# EAGLE design untitled (EAGLE 5.06)
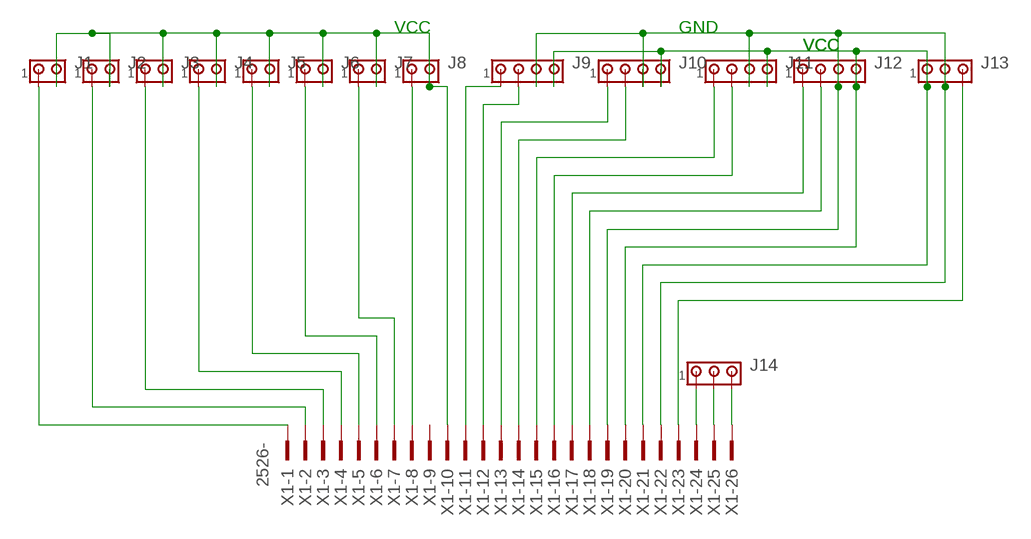
[diagram p0: schematic, sheet 1]

## Parts
J1  MTA02-100  [10X02MTA]
J2  MTA02-100  [10X02MTA]
J3  MTA02-100  [10X02MTA]
J4  MTA02-100  [10X02MTA]
J5  MTA02-100  [10X02MTA]
J6  MTA02-100  [10X02MTA]
J7  MTA02-100  [10X02MTA]
J8  MTA02-100  [10X02MTA]
J9  MTA04-100  [10X04MTA]
J10  MTA04-100  [10X04MTA]
J11  MTA04-100  [10X04MTA]
J12  MTA04-100  [10X04MTA]
J13  MTA03-100  [10X03MTA]
J14  MTA03-100  [10X03MTA]
X1  2526-  [PAK100/2500-26]

## Nets
N$1: J9.1 X1.11
N$2: J4.1 X1.4
N$3: J5.1 X1.5
N$4: J1.1 X1.1
N$5: J2.1 X1.2
N$6: J3.1 X1.3
N$7: J6.1 X1.6
N$9: J7.1 X1.7
N$10: J8.1 X1.8
N$11: J1.2 J2.2 J3.2 J4.2 J5.2 J6.2 J7.2 J8.2 X1.10
N$12: J9.4 J10.4 J11.4 J12.4 J13.1 X1.20 X1.21
N$13: J9.2 X1.12
N$14: J10.1 X1.13
N$15: J10.2 X1.14
N$16: J11.1 X1.15
N$17: J11.2 X1.16
N$18: J12.1 X1.17
N$19: J12.2 X1.18
N$20: J9.3 J10.3 J11.3 J12.3 J13.2 X1.19 X1.22
N$25: J13.3 X1.23
N$26: J14.1 X1.24
N$27: J14.2 X1.25
N$28: J14.3 X1.26
Unconnected: X1.9

## Notes on the sheet
- VCC | GND
- VCC | VCC

## Library data of the parts
J1-J8 = con-amp:MTA02-100: AMP connector
J9-J12 = con-amp:MTA04-100: AMP connector
J13 J14 = con-amp:MTA03-100: AMP connector
X1 = con-3m:2526-: 3M (TM) Pak 100 4-Wall Header Source: 3M

## Board
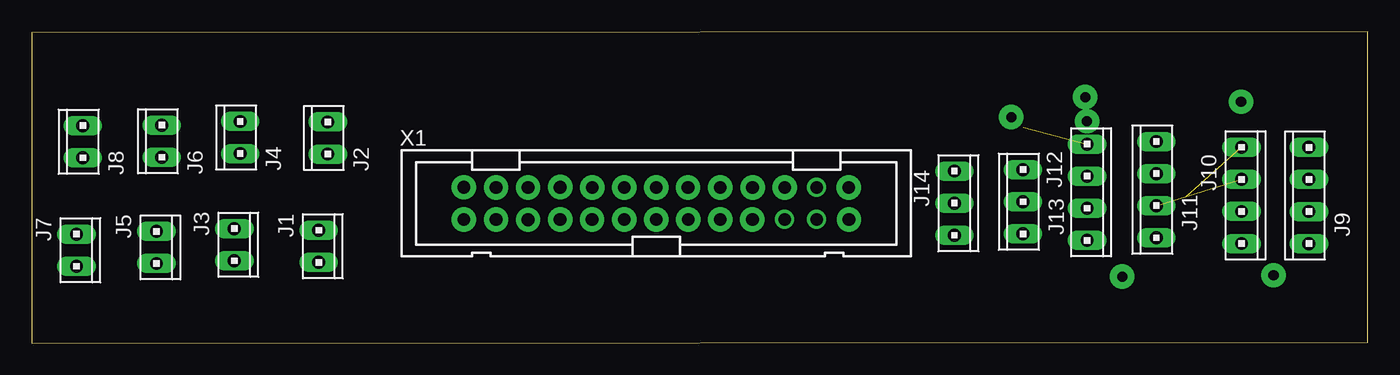
[diagram p1: board, top side]
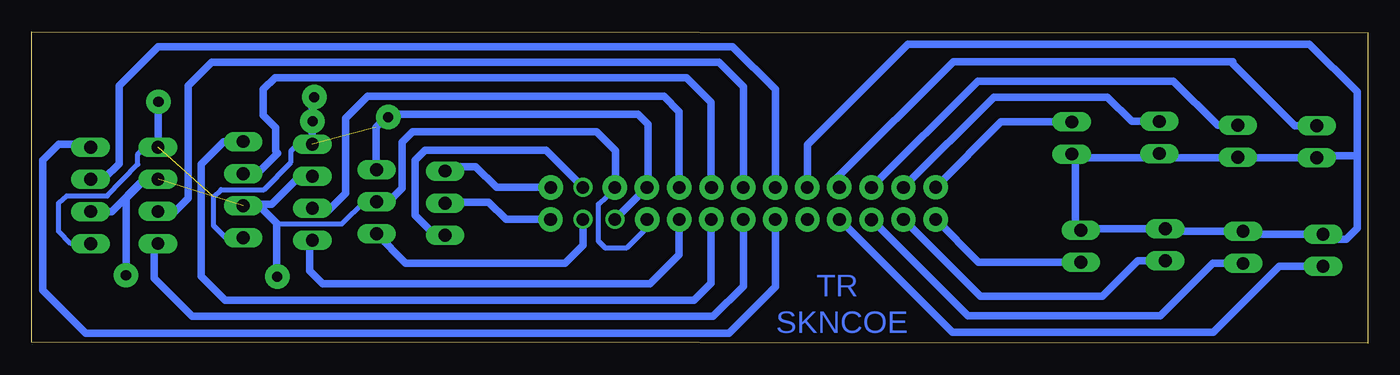
[diagram p2: board, bottom side, seen from below]

Size 105.83 x 24.66 mm. Coordinates in mm from the lower left corner, seen from the top.
Outline: 0,0 105.83,0.09 105.83,24.66 0,24.57 0,0
Copper layers (1*16): Top 0.035mm / dielectric 1.5mm / Bottom 0.035mm
Design rules "default": minimum track width 10mil, minimum drill 24mil, track to track 8mil, track to pad 8mil, pad to pad 8mil, via to via 8mil, smd to smd 8mil, copper to edge 40mil, drill to drill 8mil, minimum pad ring 10mil, minimum via ring 8mil, stop-mask expansion 4mil, vias tented up to drill 0mil, thermal gap 10mil

### Footprints (pad centres in the part's own frame; a part is rotated, then mirrored left to right if it is on the bottom)
10X02MTA = drill 1.016 long: 1 1.27,0; 2 -1.27,0
10X04MTA = drill 1.016 long: 1 3.81,0; 2 1.27,0; 3 -1.27,0; 4 -3.81,0
10X03MTA = drill 1.016 long: 1 2.54,0; 2 0,0; 3 -2.54,0
PAK100/2500-26 = drill 1 pad 1.422 round: 1 -15.24,-1.27; 2 -15.24,1.27; 3 -12.7,-1.27; 4 -12.7,1.27; 5 -10.16,-1.27; 6 -10.16,1.27; 7 -7.62,-1.27; 8 -7.62,1.27; 9 -5.08,-1.27; 10 -5.08,1.27; 11 -2.54,-1.27; 12 -2.54,1.27; 13 0,-1.27; 14 0,1.27; 15 2.54,-1.27; 16 2.54,1.27; 17 5.08,-1.27; 18 5.08,1.27; 19 7.62,-1.27; 20 7.62,1.27; 21 10.16,-1.27; 22 10.16,1.27; 23 12.7,-1.27; 24 12.7,1.27; 25 15.24,-1.27; 26 15.24,1.27

### Placement (x,y rotation side)
J1  22.74,7.66 270 top
J2  23.46,16.23 90 top
J3  16.06,7.79 270 top
J4  16.52,16.28 90 top
J5  9.88,7.57 270 top
J6  10.31,15.98 90 top
J7  3.55,7.35 270 top
J8  4.06,15.94 90 top
J9  101.16,11.69 90 top
J10  95.82,11.69 270 top
J11  89.07,12.15 90 top
J12  83.59,11.94 270 top
J13  78.51,11.19 90 top
J14  73.08,11.08 270 top
X1  49.47,11.06 0 top

### Tracks (layer width: path | path; a pad name or v marks a point on that pad's centre or on a via)
N$1
  Bottom 0.61: X1.11 46.93,4.44 50.61,0.77 101.55,0.77 104.95,4.17 104.95,14.47 103.68,15.74 101.4,15.74 J9.1
N$2
  Bottom 0.61: J4.1 18.7,17.55 20.62,19.46 29.64,19.46 X1.4
N$3
  Bottom 0.61: J5.1 12.27,6.3 16.43,2.15 31.67,2.15 X1.5
N$4
  Bottom 0.61: J1.1 30.83,6.39 X1.1
N$5
  Bottom 0.61: J2.1 29.06,17.5 X1.2
N$6
  Bottom 0.61: J3.1 18.22,6.52 21.04,3.69 30.67,3.69 X1.3
N$7
  Bottom 0.61: J6.1 11.91,17.25 15.4,20.75 30.89,20.75 X1.6
N$8  (via drill 0.8 pad 1.93)
  other vias: 98.35,5.37
N$9
  Bottom 0.61: J7.1 7.02,6.08 12.23,0.86 32.93,0.86 X1.7
N$10
  Bottom 0.61: 10.87,22.29 10.69,22.29 | J8.1 5.79,17.21 10.87,22.29 | 10.87,22.29 32.83,22.29 42,13.12 42,12.48 X1.8
N$11
  Bottom 0.61: 10.27,14.67 J8.2 | 10.27,14.67 J6.2 | 16.18,14.67 10.27,14.67 | 16.18,14.67 J4.2 | 23.17,14.67 16.18,14.67 | 23.17,14.67 J2.2 | 23.17,14.67 23.17,9.36 J1.2 22.61,9.06 16.68,9.06 | 16.68,9.06 J3.2 | 16.68,9.06 16.47,8.84 J5.2 9.66,8.62 J7.2 3.16,8.23 1.71,8.23 0.86,9.09 0.86,14.83 | X1.10 44.39,15.71 36.44,23.66 4.63,23.66 0.86,19.89 0.86,14.83 | 0.86,14.83 4.19,14.83 4.19,14.75
N$12  (2 unrouted)
  Bottom 0.406: J11.4 90.45,8.34 91.41,9.3 91.41,11.6 90.83,12.16 87.43,12.16 85.29,14.32 85.29,15.21 84.72,15.79 83.63,15.79 J12.4 | J9.4 102.73,7.88 103.7,8.84 103.7,11.1 103.06,11.66 99.83,11.66 97.41,14.15 97.41,14.95 96.76,15.6 95.92,15.6 J10.4
  Bottom 0.61: X1.20 X1.21 57.02,12.4 57.02,17.32 57.81,18.1 77.54,18.1 78.54,17.1 78.54,13.77 J13.1 | J10.4 95.82,19.03 95.81,19.04 | J12.4 83.59,19.13 83.55,19.18
N$13
  Bottom 0.61: X1.12 46.93,20.09 50.31,23.47 95.79,23.47 98.9,20.36 98.9,14.21 100.1,13.01 101.11,13.01 J9.2
N$14
  Bottom 0.61: X1.13 49.47,4.5 51.85,2.11 93.1,2.11 96.1,5.11 96.1,7.6 J10.1
N$15
  Bottom 0.61: X1.14 49.47,20.28 51.4,22.21 91.56,22.21 93.41,20.36 93.41,11.46 94.61,10.27 95.66,10.27 J10.2
N$16
  Bottom 0.61: X1.15 52.01,4.75 53.39,3.38 90.51,3.38 92.41,5.28 92.41,14.17 90.62,15.96 J11.1
N$17
  Bottom 0.61: X1.16 52.01,19.07 53.96,21.02 86.54,21.02 87.48,20.07 87.48,18.03 86.52,17.06 86.52,15.24 86.32,15.04 87.99,13.37 89.03,13.37 J11.2
N$18
  Bottom 0.61: X1.17 54.55,7.01 56.85,4.71 82.79,4.71 83.79,5.71 83.79,7.93 J12.1
N$19
  Bottom 0.61: X1.18 54.55,18.32 55.75,19.52 79.23,19.52 80.96,17.79 80.96,11.88 82.39,10.45 83.37,10.45 J12.2
N$20  (via drill 0.8 pad 1.93)  (1 unrouted)
  Bottom 0.406: X1.19 57.09,9.14 58.71,7.51 60.39,7.51 60.94,8.06 60.94,11 59.63,12.22 X1.22 | J13.2 79.46,11.19 81.27,9.41 86.29,9.41 87.9,11
  Bottom 0.61: J12.3 84.59,13.21 86.81,11 87.9,11 88.95,11 J11.3 87.8,10.88 86.41,9.49 86.41,5.29 v86.37,5.26 | J9.3 99.48,10.42 96.94,12.95 J10.3 96.82,12.96 98.32,11.46 98.32,5.44 98.35,5.4 | J13.2 77.54,11.19 76.47,12.25 76.47,15.92 75.65,16.74 61.1,16.74 59.59,15.23 59.59,12.36 X1.22
N$21  (via drill 0.8 pad 1.93)
  other vias: 83.44,19.47
N$22  (via drill 0.8 pad 1.93)
  other vias: 77.58,17.89
N$23  (via drill 0.8 pad 1.93)
  other vias: 83.59,17.56
N$24  (via drill 0.8 pad 1.93)
  other vias: 95.78,19.11
N$25
  Bottom 0.61: X1.23 62.17,7.73 63.56,6.33 76.19,6.33 J13.3
N$26
  Bottom 0.61: J14.1 73.86,8.54 75.44,10.12 75.44,14.49 74.67,15.26 65.1,15.26 X1.24
N$27
  Bottom 0.61: X1.25 68.26,9.79 69.62,11.15 73.01,11.15 J14.2
N$28
  Bottom 0.61: X1.26 69,12.33 70.65,13.98 72.72,13.98 J14.3
N$29  (via drill 1 pad 1.93)
  other vias: 34.23,12.34
N$30  (via drill 1 pad 1.93)
  other vias: 34.23,9.78
N$31  (via drill 1 pad 1.93)
  other vias: 36.79,9.78
N$32  (via drill 1 pad 1.93)
  other vias: 36.79,12.32
N$33  (via drill 1 pad 1.93)
  other vias: 39.32,12.32
N$34  (via drill 1 pad 1.93)
  other vias: 39.32,9.77
N$35  (via drill 1 pad 1.93)
  other vias: 41.86,9.77
N$36  (via drill 1 pad 1.93)
  other vias: 41.86,12.35
N$37  (via drill 1 pad 1.93)
  other vias: 44.39,12.32
N$38  (via drill 1 pad 1.93)
  other vias: 44.38,9.77
N$39  (via drill 1 pad 1.93)
  other vias: 46.93,9.78
N$40  (via drill 1 pad 1.93)
  other vias: 46.93,12.33
N$41  (via drill 1 pad 1.93)
  other vias: 49.48,12.33
N$42  (via drill 1 pad 1.93)
  other vias: 49.48,9.77
N$43  (via drill 1 pad 1.93)
  other vias: 52,9.78
N$44  (via drill 1 pad 1.93)
  other vias: 51.99,12.33
N$45  (via drill 1 pad 1.93)
  other vias: 54.53,12.31
N$46  (via drill 1 pad 1.93)
  other vias: 54.52,9.79
N$47  (via drill 1 pad 1.93)
  other vias: 57.08,9.77
N$48  (via drill 1 pad 1.93)
  other vias: 57.11,12.33
N$49  (via drill 1 pad 1.93)
  other vias: 64.72,12.32
N$50  (via drill 1 pad 1.93)
  other vias: 59.63,12.33
N$51  (via drill 1 pad 1.93)
  other vias: 64.73,9.78

### Text on the board
Bottom: TR | SKNCOE